# Altium schematic sheet DALI.SchDoc
size A3
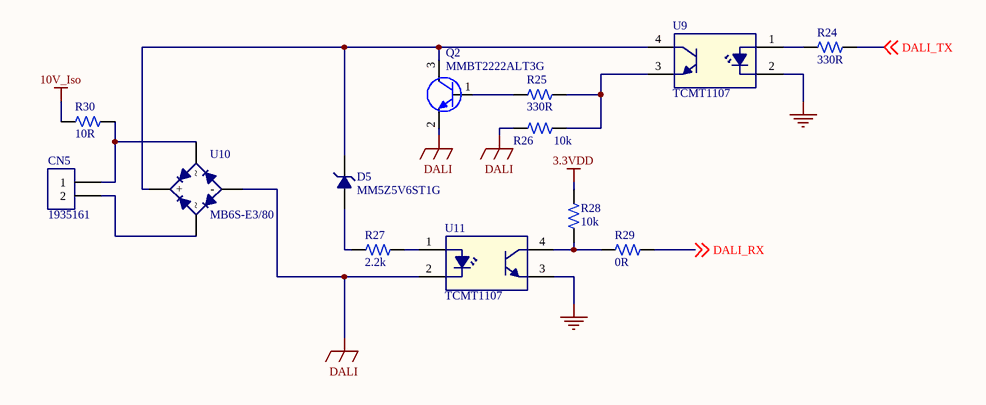
[diagram p0: DALI.SchDoc]

## Parts
CN5  1935161  [TERM BLOCK PCB 2POS 5.0MM]
D5  MM5Z5V6ST1G  [SOD-523-3D]
Q2  MMBT2222ALT3G  [SOT23-3D]
R24  value 330R  [0603-3D]  (hidden comment: RES SMD 330 OHM 5% 1/10W 0603)
R25  value 330R  [0603-3D]  (hidden comment: RES SMD 330 OHM 5% 1/10W 0603)
R26  10k  [0603-3D]
R27  2.2k  [0603-3D]
R28  10k  [0603-3D]
R29  0R  [0603-3D]
R30  10R  [0603-3D]
U9  TCMT1107  [SOP4]
U10  value MB6S-E3/80  [TO-269AA-3D]  (hidden comment: Bridge Rectifier Single Phase 600V 500mA Surface Mount TO-269AA (MBS))
U11  TCMT1107  [SOP4]

## Nets
3.3VDD: R28.1
10V_Iso: R30.1
DALI: Q2.2(E) R26.2 U10.4(-) U11.2(K)
GND: U9.2(K) U11.3(E)
DALI_RX: R29.2 ; off-sheet DALI_RX
DALI_TX: R24.2 ; off-sheet DALI_TX
NetCN5_1: CN5.1 R30.2 U10.2
NetCN5_2: CN5.2 U10.1
NetD5_1: D5.1 R27.2
NetD5_2: D5.2 Q2.3(C) U9.4(C) U10.3(+)
NetQ2_1: Q2.1(B) R25.1
NetR24_1: R24.1 U9.1(A)
NetR25_2: R25.2 R26.1 U9.3(E)
NetR27_1: R27.1 U11.1(A)
NetR28_2: R28.2 R29.1 U11.4(C)

## Notes on the sheet
- Title
- Modified Date:
- Project:
- Draw by:
- Current Date:
- Approved by:
- Sheet
- Revision:
- of
- Instituto Nacional de Telecomunicações
- Av. João de Camargo, 510
- Santa Rita do Sapucaí - MG
- 3754000
- INATEL
- Size:
- A3
- File:
- +55 35 3471-9200

## Library data of the parts
CN5 = 1935161  TERM BLOCK PCB 2X1: TERM BLOCK PCB 2POS 5.0MM; User: Rodrigo Balbi; Code: *; Creation Date: 2015/11/30; Size: -; Version: V02; Supplier 1: Digikey; Supplier Part Number 1: 277-1667-ND; Supplier 2: Mouser; Supplier 3: Newarc; Supplier Part Number 2: 651-1935161; Supplier Part Number 3: 70R0063; Value: 1935161
D5 = MM5Z5V6ST1G DIODE ZENER 5.61V 500MW: DIODE ZENER 5.61V 500MW SOD523; User: Larissa; Code: *; Creation: 2017/09/12; Size: SOD523; Version: V01; Supplier 1: Digi-Key; Supplier 2: Mouser; Supplier Part Number 1: MM5Z5V6ST1GOSCT-ND; Supplier Part Number 2: 863-MM5Z5V6ST1G; Supplier 3: Farnell; Supplier Part Number 3: 10N9531; Value: MM5Z5V6ST1G
Q2 = MMBT2222ALT3G TRANS NPN SOT23: TRANS NPN 40V 0.6A SOT-23; User: Larissa; Code: *; Creation Date: 2017/09/08; Size: SOT23; Version: V01; Supplier 1: Digi-Key; Supplier Part Number 1: MMBT2222ALT3GOSCT-ND; Supplier 2: Mouser; Supplier 3: Newark; Supplier Part Number 2: 863-MMBT2222ALT3G; Supplier Part Number 3: 10N9478; Value: MMBT2222ALT3G
R24 R25 = 330R 5% 0603 TKF 1/10W: User: Luiz F Siecola; Code: *; Creation Date: 2017/05/03; Version: V02; Size: 0603; Supplier 1: Digi-Key; Supplier Part Number 1: P330GCT-ND; Tolerance: 5%; Supplier 2: Mouser; Supplier 3: Newark; Supplier Part Number 2: 667-ERJ-3GEYJ331V; Supplier Part Number 3: 65T8629
R26 R28 = 10k 1% 0603 TNF 1/10W: RES SMD 10K OHM 1% 1/10W 0603; Manufacturer: Yageo; Manufacturer Part Number: RC0603FR-0710KL; User: Pedro Vilela; Code: *; Creation Date: 2018/09/28; Version: V03; Size: 0603; Supplier 1: Digi-Key; Supplier 2: Mouser; Supplier 3: Newark; Supplier Part Number 1: 311-10.0KHRCT-ND; Supplier Part Number 2: 603-RC0603FR-0710KL; Supplier Part Number 3: 68X3181; Tolerance: 1%; ComponentLink1Description: 311-10.0KHRCT-ND; ComponentLink1URL: https://www.digikey.com/products/en?keywords=311-10.0KHRCT-ND; Value: 10k
R27 = 2.2k 5% 0603 TKF 1/10W: RES SMD 2.2K OHM 5% 1/10W 0603; User: Rodrigo Balbi; Code: *; Creation Date: 2015/11/10; Supplier Link 1: http://www.digikey.com/product-detail/en/RMCF0805FT2K20/RMCF0805FT2K20CT-ND/1942387; Version: V02; Supplier 1: Digi-Key; Supplier 2: Mouser; Supplier 3: Newarc; Supplier Part Number 1: P2.2KGCT-ND; Supplier Part Number 2: 667-ERJ-3GEYJ222V; Supplier Part Number 3: 65T8604; Size: 0603; Value: 2.2k; Tolerance: 5%
R29 = 0R 0603 TKF 1/10W: RES SMD 0.0OHM JUMPER 1/10W 0603; User: Reis; Creation Date: 2017/04/11; Version: V01; Size: 0603; Supplier 1: Digikey; Supplier 2: Mouser; Supplier 3: Newark; Supplier Part Number 1: 311-0.0GRCT-ND; Supplier Part Number 2: 603-RC0603JR-070RL; Supplier Part Number 3: 74K0306; Value: 0R
R30 = 10R 5% 0603 TKF 1/10W: RES SMD 10 OHM 5% 1/10W 0603; User: Rodrigo Villela; Code: *; Creation Date: 2015/08/26; Version: V01; Size: 0603; Supplier 1: Digi-Key; Supplier Part Number 1: 311-10GRCT-ND; Tolerance: 5%; Value: 10R
U9 U11 = TCMT1107 OPTO TRANS: OPTOISOLATOR 3.75KV TRANS 4-SOP; User: Jean Pierre; Code: *; Creation Date: 2017/06/23; Size: 4-SOP; Version: V01; Supplier 1: Digi-Key; Supplier 2: Mouser; Supplier 3: Newark; Supplier Part Number 1: TCMT1107CT-ND; Supplier Part Number 2: 782-TCMT1107; Supplier Part Number 3: 35C2113; Value: TCMT1107
U10 = MB6S-E3/80 BRIDGE RECTIFIER SINGLE: User: Reis; Creation Date: 2017/05/08; Descrition: Bridge Rectifier Single Phase 600V 500mA Surface Mount TO-269AA (MBS); Size: TO-269AA (MBS); Supplier 1: Digi-Key; Code: *; Version: V0.2; Supplier 2: Mouser; Supplier 3: Newark; Supplier Part Number 1: MB6S-E3/80GICT-ND; Supplier Part Number 2: 625-MB6S-E3/80; Supplier Part Number 3: 75R2117